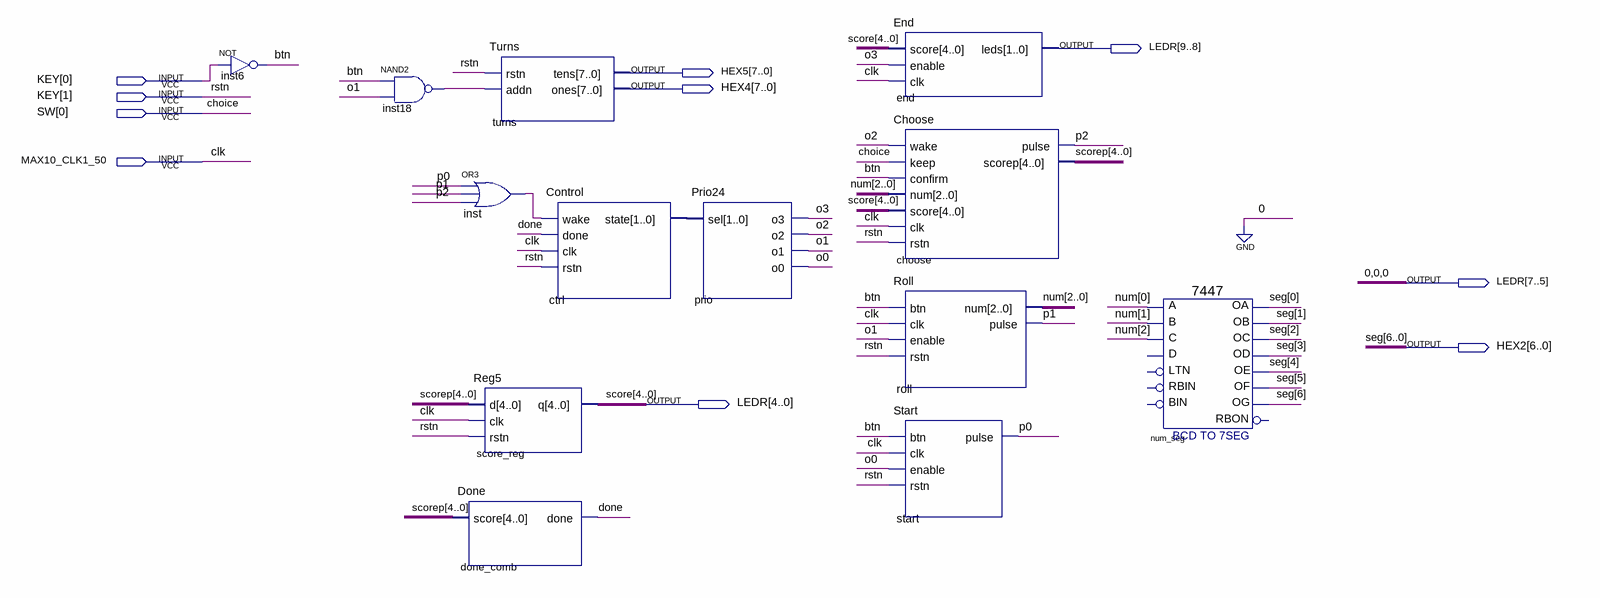
[diagram p0: schematic sheet]
// Quartus schematic Game.bdf as structural Verilog: 13 symbols, 10 pins
module Game (
  input  [1:0] KEY,
  input  [0:0] SW,
  input  MAX10_CLK1_50,
  output [9:0] LEDR,
  output [7:0] HEX5,
  output [7:0] HEX4,
  output [6:0] HEX2
);

  wire btn, done, inst18_out, inst_out, o0, o1, o2, o3, p0, p1, p2;
  wire [1:0] ctrl_state;
  wire [2:0] num;
  wire [4:0] scorep;

  not inst6 (btn, KEY[0]);
  nand inst18 (inst18_out, btn, o1);
  or inst (inst_out, p0, p1, p2);
  Done done_comb (.score(scorep), .done(done));
  Turns turns (.rstn(KEY[1]), .addn(inst18_out), .tens(HEX5), .ones(HEX4));
  Reg5 score_reg (.d(scorep), .clk(MAX10_CLK1_50), .rstn(KEY[1]), .q(LEDR[4:0]));
  Control ctrl (.wake(inst_out), .done(done), .clk(MAX10_CLK1_50), .rstn(KEY[1]), .state(ctrl_state));
  Prio24 prio (.sel(ctrl_state), .o3(o3), .o2(o2), .o1(o1), .o0(o0));
  End \end  (.score(LEDR[4:0]), .enable(o3), .clk(MAX10_CLK1_50), .leds(LEDR[9:8]));
  Choose choose (
    .wake(o2), .keep(SW[0]), .confirm(btn), .num(num), .score(LEDR[4:0]), .clk(MAX10_CLK1_50), .rstn(KEY[1]),
    .pulse(p2), .scorep(scorep));
  Roll roll (.btn(btn), .clk(MAX10_CLK1_50), .enable(o1), .rstn(KEY[1]), .num(num), .pulse(p1));
  Start start (.btn(btn), .clk(MAX10_CLK1_50), .enable(o0), .rstn(KEY[1]), .pulse(p0));
  \7447  num_seg (
    .B(num[1]), .C(num[2]), .A(num[0]), .OB(HEX2[1]), .OC(HEX2[2]), .OE(HEX2[4]), .OD(HEX2[3]), .OF(HEX2[5]),
    .OG(HEX2[6]), .OA(HEX2[0]));  // open: LTN, D, RBIN, BIN, RBON

  assign LEDR[7:5] = 3'b000;

  // Other names for the same wires on the sheet: choice = SW[0]; clk = MAX10_CLK1_50; rstn = KEY[1];
  //   score[4:0] = LEDR[4:0]; seg[6:0] = HEX2
endmodule
